# Altium schematic sheet LED.SchDoc
size A4
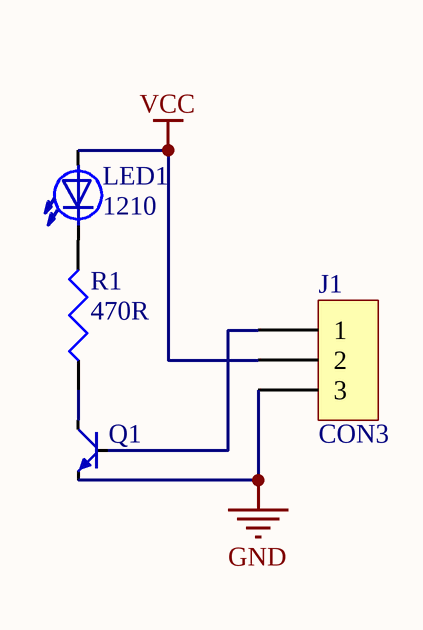
[diagram p0: LED.SchDoc]

## Parts
J1  CON3  [DevModule]
LED1  1210  [C1210_N]
Q1  BJT_NPN  [SOT23-3]  (value not drawn)
R1  470R  [6-0805_N]

## Nets
GND: J1.3 Q1.2(E)
VCC: J1.2 LED1.1(A)
NetJ1_1: J1.1 Q1.1(B)
NetLED1_2: LED1.2(K) R1.2
NetQ1_3: Q1.3(C) R1.1

## Library data of the parts
J1 = CON3: Connector
LED1 = LED_3
Q1 = BJT_NPN: Transistor
R1 = RES1_1